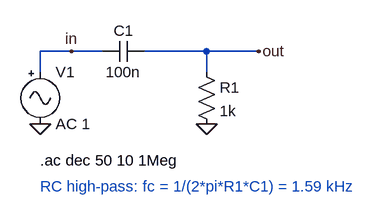
[diagram p0: schematic rc_highpass.asc]
rc_highpass.asc, the LTspice schematic file:
Version 4
SHEET 1 880 680
WIRE 32 112 32 144
WIRE 128 112 32 112
WIRE 288 112 192 112
WIRE 368 112 288 112
WIRE 288 144 288 112
FLAG 32 224 0
FLAG 288 224 0
FLAG 80 112 in
FLAG 368 112 out
SYMBOL Misc\signal 32 128 R0
SYMATTR InstName V1
SYMATTR Value AC 1
SYMBOL cap 192 96 R90
WINDOW 0 0 32 VBottom 2
WINDOW 3 32 32 VTop 2
SYMATTR InstName C1
SYMATTR Value 100n
SYMBOL res 272 128 R0
SYMATTR InstName R1
SYMATTR Value 1k
TEXT 32 280 Left 2 !.ac dec 50 10 1Meg
TEXT 32 320 Left 2 ;RC high-pass: fc = 1/(2*pi*R1*C1) = 1.59 kHz

The netlist it stands for:
* rc_highpass.asc
V1 in 0 AC 1
C1 out in 100n
R1 out 0 1k
.ac dec 50 10 1Meg
* RC high-pass: fc = 1/(2*pi*R1*C1) = 1.59 kHz
.backanno
.end